# Altium schematic sheet Sensor_Multiplexation.SchDoc
size A4
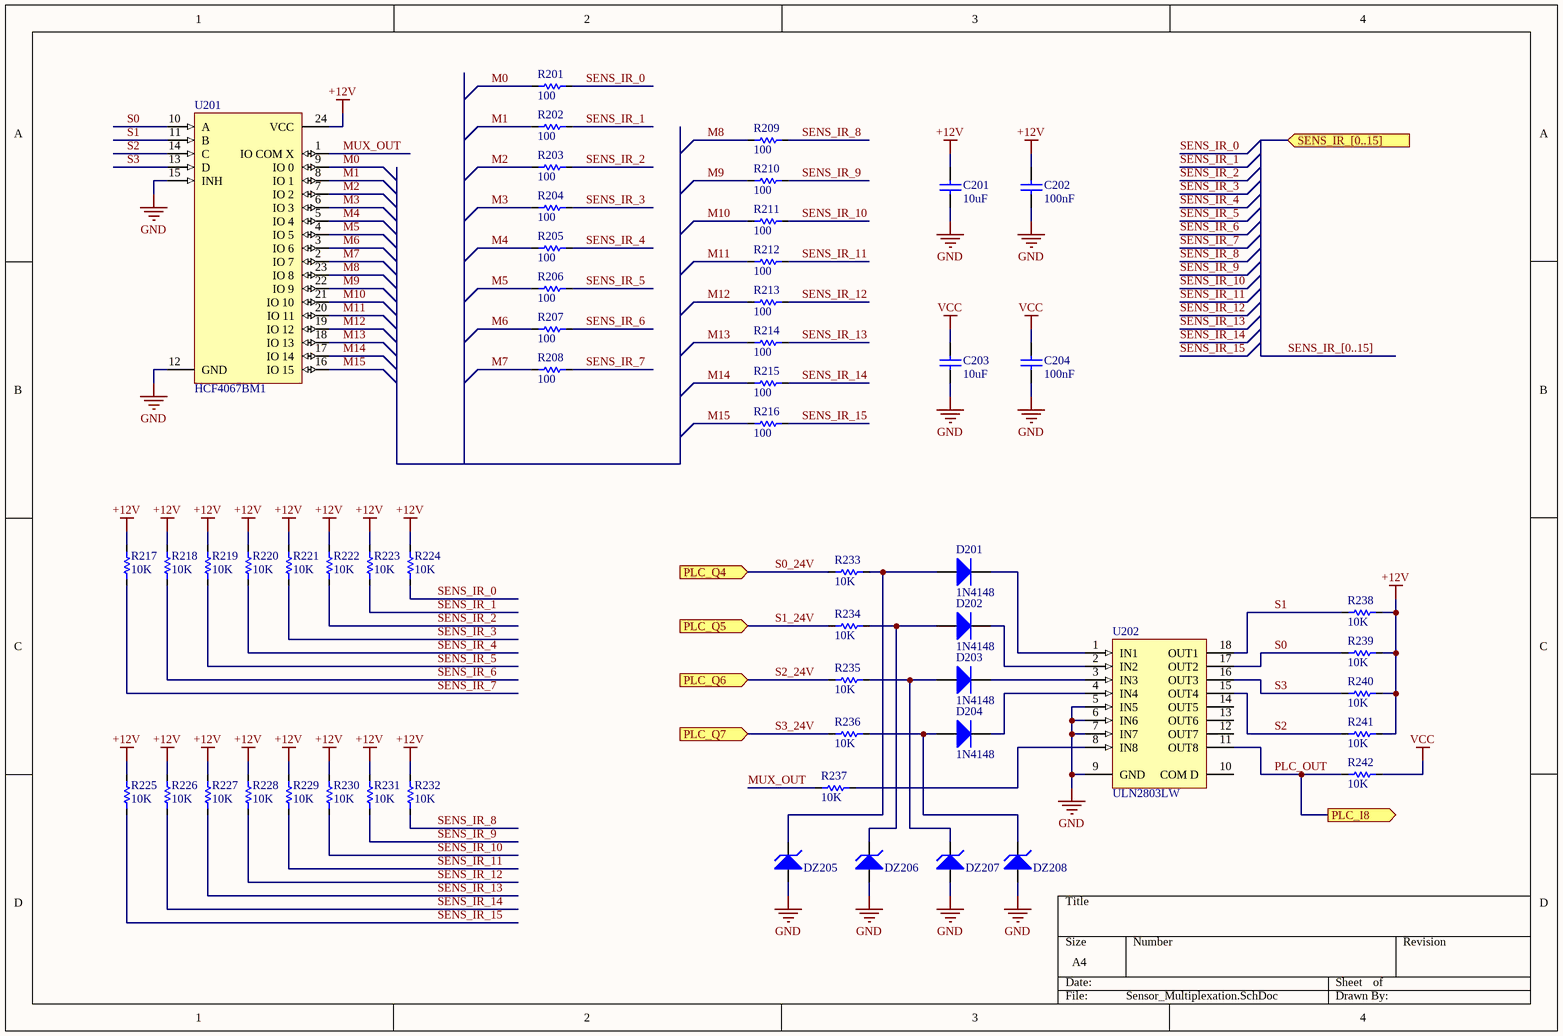
[diagram p0: Sensor_Multiplexation.SchDoc]

## Parts
C201  VALOR: 10uF  [C0603]  (hidden comment: Cap Ceramico SMD)
C202  VALOR: 100nF  [C0603]  (hidden comment: Cap Ceramico SMD)
C203  VALOR: 10uF  [C0603]  (hidden comment: Cap Ceramico SMD)
C204  VALOR: 100nF  [C0603]  (hidden comment: Cap Ceramico SMD)
D201  VALOR: 1N4148  [SOD-80]  (hidden comment: Diodo Rectificador SMD)
D202  VALOR: 1N4148  [SOD-80]  (hidden comment: Diodo Rectificador SMD)
D203  VALOR: 1N4148  [SOD-80]  (hidden comment: Diodo Rectificador SMD)
D204  VALOR: 1N4148  [SOD-80]  (hidden comment: Diodo Rectificador SMD)
DZ205  Diodo Zenner SMD  [SOD-80]  (value not drawn)
DZ206  Diodo Zenner SMD  [SOD-80]  (value not drawn)
DZ207  Diodo Zenner SMD  [SOD-80]  (value not drawn)
DZ208  Diodo Zenner SMD  [SOD-80]  (value not drawn)
R201  VALOR: 100  [R0603]  (hidden comment: Res SMD)
R202  VALOR: 100  [R0603]  (hidden comment: Res SMD)
R203  VALOR: 100  [R0603]  (hidden comment: Res SMD)
R204  VALOR: 100  [R0603]  (hidden comment: Res SMD)
R205  VALOR: 100  [R0603]  (hidden comment: Res SMD)
R206  VALOR: 100  [R0603]  (hidden comment: Res SMD)
R207  VALOR: 100  [R0603]  (hidden comment: Res SMD)
R208  VALOR: 100  [R0603]  (hidden comment: Res SMD)
R209  VALOR: 100  [R0603]  (hidden comment: Res SMD)
R210  VALOR: 100  [R0603]  (hidden comment: Res SMD)
R211  VALOR: 100  [R0603]  (hidden comment: Res SMD)
R212  VALOR: 100  [R0603]  (hidden comment: Res SMD)
R213  VALOR: 100  [R0603]  (hidden comment: Res SMD)
R214  VALOR: 100  [R0603]  (hidden comment: Res SMD)
R215  VALOR: 100  [R0603]  (hidden comment: Res SMD)
R216  VALOR: 100  [R0603]  (hidden comment: Res SMD)
R217  VALOR: 10K  [R0603]  (hidden comment: Res SMD)
R218  VALOR: 10K  [R0603]  (hidden comment: Res SMD)
R219  VALOR: 10K  [R0603]  (hidden comment: Res SMD)
R220  VALOR: 10K  [R0603]  (hidden comment: Res SMD)
R221  VALOR: 10K  [R0603]  (hidden comment: Res SMD)
R222  VALOR: 10K  [R0603]  (hidden comment: Res SMD)
R223  VALOR: 10K  [R0603]  (hidden comment: Res SMD)
R224  VALOR: 10K  [R0603]  (hidden comment: Res SMD)
R225  VALOR: 10K  [R0603]  (hidden comment: Res SMD)
R226  VALOR: 10K  [R0603]  (hidden comment: Res SMD)
R227  VALOR: 10K  [R0603]  (hidden comment: Res SMD)
R228  VALOR: 10K  [R0603]  (hidden comment: Res SMD)
R229  VALOR: 10K  [R0603]  (hidden comment: Res SMD)
R230  VALOR: 10K  [R0603]  (hidden comment: Res SMD)
R231  VALOR: 10K  [R0603]  (hidden comment: Res SMD)
R232  VALOR: 10K  [R0603]  (hidden comment: Res SMD)
R233  VALOR: 10K  [R0603]  (hidden comment: Res SMD)
R234  VALOR: 10K  [R0603]  (hidden comment: Res SMD)
R235  VALOR: 10K  [R0603]  (hidden comment: Res SMD)
R236  VALOR: 10K  [R0603]  (hidden comment: Res SMD)
R237  VALOR: 10K  [R0603]  (hidden comment: Res SMD)
R238  VALOR: 10K  [R0603]  (hidden comment: Res SMD)
R239  VALOR: 10K  [R0603]  (hidden comment: Res SMD)
R240  VALOR: 10K  [R0603]  (hidden comment: Res SMD)
R241  VALOR: 10K  [R0603]  (hidden comment: Res SMD)
R242  VALOR: 10K  [R0603]  (hidden comment: Res SMD)
U201  HCF4067BM1  [SO24_M]
U202  ULN2803LW  [LW18_M]

## Ports
PLC_I8 (out), PLC_Q4 (in), PLC_Q5 (in), PLC_Q6 (in), PLC_Q7 (in), SENS_IR_[0..15] (in)

## Nets
+12V: C201.1 C202.1 R217.1 R218.1 R219.1 R220.1 R221.1 R222.1 R223.1 R224.1 R225.1 R226.1 R227.1 R228.1 R229.1 R230.1 R231.1 R232.1 R238.2 R239.2 R240.2 R241.2 U201.24(VCC)
GND: C201.2 C202.2 C203.2 C204.2 DZ205.1(A) DZ206.1(A) DZ207.1(A) DZ208.1(A) U201.12(GND) U201.15(INH) U202.5(IN5) U202.6(IN6) U202.7(IN7) U202.9(GND)
VCC: C203.1 C204.1 R242.2
M0: R201.2 U201.9(IO_0)
M1: R202.2 U201.8(IO_1)
M2: R203.2 U201.7(IO_2)
M3: R204.2 U201.6(IO_3)
M4: R205.2 U201.5(IO_4)
M5: R206.2 U201.4(IO_5)
M6: R207.2 U201.3(IO_6)
M7: R208.2 U201.2(IO_7)
M8: R209.2 U201.23(IO_8)
M9: R210.2 U201.22(IO_9)
M10: R211.2 U201.21(IO_10)
M11: R212.2 U201.20(IO_11)
M12: R213.2 U201.19(IO_12)
M13: R214.2 U201.18(IO_13)
M14: R215.2 U201.17(IO_14)
M15: R216.2 U201.16(IO_15)
MUX_OUT: R237.1 U201.1(IO_COM_X)
PLC_OUT: R242.1 U202.11(OUT8) ; port PLC_I8
S0: R239.1 U201.10(A) U202.17(OUT2)
S0_24V: R233.1 ; port PLC_Q4
S1: R238.1 U201.11(B) U202.18(OUT1)
S1_24V: R234.1 ; port PLC_Q5
S2: R241.1 U201.14(C) U202.15(OUT4)
S2_24V: R235.1 ; port PLC_Q6
S3: R240.1 U201.13(D) U202.16(OUT3)
S3_24V: R236.1 ; port PLC_Q7
SENS_IR_0: R201.1 R224.2
SENS_IR_1: R202.1 R223.2
SENS_IR_2: R203.1 R222.2
SENS_IR_3: R204.1 R221.2
SENS_IR_4: R205.1 R220.2
SENS_IR_5: R206.1 R219.2
SENS_IR_6: R207.1 R218.2
SENS_IR_7: R208.1 R217.2
SENS_IR_8: R209.1 R232.2
SENS_IR_9: R210.1 R231.2
SENS_IR_10: R211.1 R230.2
SENS_IR_11: R212.1 R229.2
SENS_IR_12: R213.1 R228.2
SENS_IR_13: R214.1 R227.2
SENS_IR_14: R215.1 R226.2
SENS_IR_15: R216.1 R225.2
NetD201_1: D201.1(A) DZ205.2(K) R233.2
NetD201_2: D201.2(K) U202.1(IN1)
NetD202_1: D202.1(A) DZ206.2(K) R234.2
NetD202_2: D202.2(K) U202.2(IN2)
NetD203_1: D203.1(A) DZ207.2(K) R235.2
NetD203_2: D203.2(K) U202.3(IN3)
NetD204_1: D204.1(A) DZ208.2(K) R236.2
NetD204_2: D204.2(K) U202.4(IN4)
NetR237_2: R237.2 U202.8(IN8)

Not connected (* = marked no-connect by the designer): U202 10(COM_D) 12(OUT7) 13(OUT6) 14(OUT5)

## Buses and harness runs
bus SENS_IR_[0..15] = port SENS_IR_[0..15]

## Library data of the parts
C201-C204 = Cap Ceramico SMD: Cap Ceramico SMD 0805; CODIGO RUF: *; PROVEEDOR: *; FABRICANTE: *
  C201 C203: Arrow: CL10A106MQ8NNNC; Digikey: 1276-1119-1-ND
  C202 C204: Arrow: C0603C104K5RACAUTO; Digikey: 399-6856-1-ND
D201-D204 = Diodo Rectificador SMD: Diodo Rectificador; PROVEEDOR: *; CODIGO RUF: *; FABRIANTE: *; Arrow: FDLL4148; Digikey: FDLL4148TR-ND
U201 = HCF4067BM1: Analog Multiplexer/Demultiplexer; Published: 8-Jun-2000; LatestRevisionDate: 13-Apr-2006; LatestRevisionNote: IPC-7351 Footprint Added.; DatasheetVersion: Sep-1988; PackageVersion: Oct-2001; PackageReference: SO24; Publisher: Altium Limited; PackageDescription: 24-Pin Plastic Small Outline Integrated Circuit 1.27 mm Pitch; ComponentLink1Description: Manufacturer Link; ComponentLink1URL: http://www.st.com/; ComponentLink2Description: Datasheet; ComponentLink2URL: http://www.st.com/stonline/products/literature/ds/2058/hcf4067.pdf; Arrow: MC74HC4067ADWR2G; Digikey: MC74HC4067ADWR2GOSCT-ND
U202 = ULN2803LW: High-Voltage, High-Current Darlington Array; Published: 13-Oct-2000; LatestRevisionDate: 13-Apr-2006; LatestRevisionNote: IPC-7351 Footprint Added.; DatasheetVersion: 1999; PackageReference: LW18; Publisher: Altium Limited; PackageDescription: 18-Pin Small Outline Integrated Circuit 1.27 mm Pitch; Code_JEDEC: MS-013-AB; ComponentLink1Description: Manufacturer Link; ComponentLink1URL: http://www.allegromicro.com/; Arrow: ULN2803ADW; Digikey: ULN2803ADW-ND
DZ205-DZ208 = Diodo Zenner SMD: VALOR: *; PROVEEDOR: *; CODIGO RUF: *; FABRICANTE: *; Arrow: TLZ10C-GS08; Digikey: 112-TLZ10C-GS08CT-ND
R201-R242 = Res SMD: CODIGO RUF: *; PROVEEDOR: *; FABRICANTE: *
  R201-R216: Arrow: RC0603FR-07100RL; Digikey: 311-100HRCT-ND
  R217-R242: Arrow: MCT06030C1002FP500; Digikey: RMCF0603FT10K0CT-ND